# Altium project Controls_PcbPrj.PrjPcb
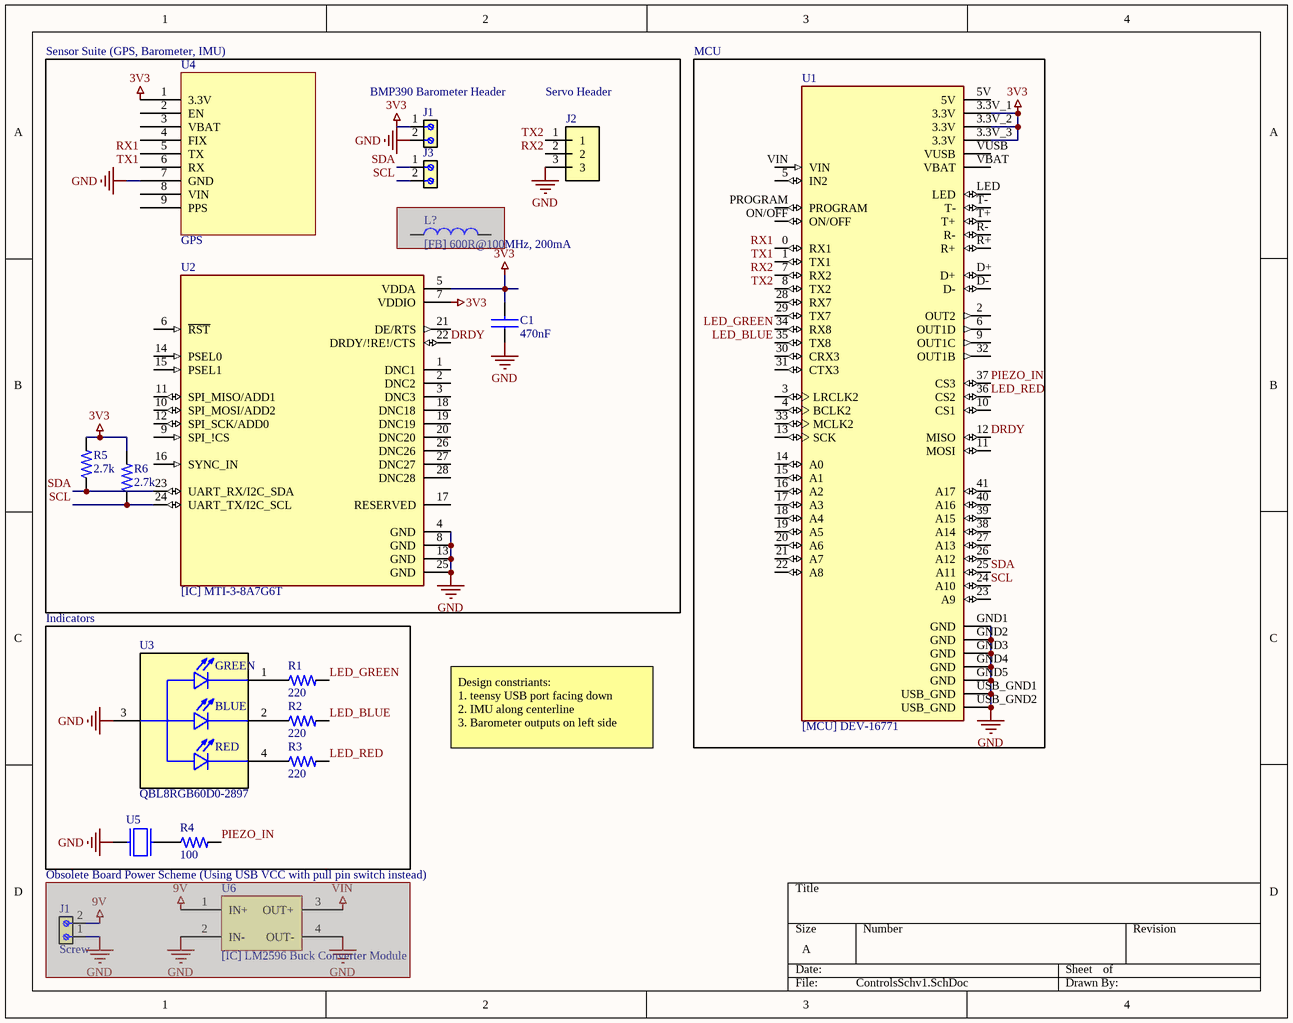
[diagram p0: ControlsSchv1.SchDoc]
1 sheet, 18 parts. Net scope: global (net labels, ports and power ports of the same name join across sheets).
Board file: ControlsPcbv3.PcbDoc

## Sheet ControlsSchv1.SchDoc
size A; SheetNumber: 1; SheetTotal: 1

### Parts
(Parts that share a designator on the sheet are numbered #1, #2 ... from top to bottom, then left to right.)
C1  470nF  [[CAP] CAPC_TH_100MIL]
J1#1  [Connector] 691213510002  [[CONNECTOR] 5MM_2PORT_SCREW]  (value not drawn)
J1#2  Screw  [[CONN] 5MM_2PORT_SCREW]  (masked out: inside a compile mask, not in the netlist)
J2  [Connector]1x3_Header  [3POS_5MM_PHOENIX]  (value not drawn)
J3  [Connector] 691213510002  [[CONNECTOR] 5MM_2PORT_SCREW]  (value not drawn)
L?  [FB] 600R@100MHz, 200mA  [[FB] WE-CBF_0603_W2.6]  (masked out: inside a compile mask, not in the netlist)
R1  220  [[RES] 1/4W TH RES]
R2  220  [[RES] 1/4W TH RES]
R3  220  [[RES] 1/4W TH RES]
R4  100  [[RES] 1/4W TH RES]
R5  2.7k  [[RES] 1/4W TH RES]
R6  2.7k  [[RES] 1/4W TH RES]
U1  [MCU] DEV-16771  [[MCU] MODULE_DEV-16771]
U2  [IC] MTI-3-8A7G6T  [[IC] DIP28]
U3  QBL8RGB60D0-2897  [[LED] LED_QBL8RGB60D0-2897]
U4  GPS  [[IC] Ultimate-GPS-v3]
U5  [Act] PS1240P02BT  [[ACT] XDCR_PS1240P02BT - duplicate]  (value not drawn)
U6  [IC] LM2596 Buck Converter Module  [[IC] LM2596 Module - duplicate]  (masked out: inside a compile mask, not in the netlist)

### Blocks framed on the sheet
MCU: U1
Indicators: R1-R4 U3 U5

### Nets
3V3: C1.2(N) J1#1.1 R5.2 R6.2 U1.3.3V_1(3.3V) U1.3.3V_2(3.3V) U1.3.3V_3(3.3V) U2.5(VDDA) U2.7(VDDIO) U4.1(3.3V)
GND: C1.1(P) J1#1.2 J2.3 U1.GND1(GND) U1.GND2(GND) U1.GND3(GND) U1.GND4(GND) U1.GND5(GND) U1.USB_GND1(USB_GND) U1.USB_GND2(USB_GND) U2.4(GND) U2.8(GND) U2.13(GND) U2.25(GND) U3.3(COMMON_ANODE) U4.7(GND) U5.1
DRDY: U1.12(MISO) U2.22(DRDY/!RE!/CTS)
LED_BLUE: R2.2 U1.35(TX8)
LED_GREEN: R1.2 U1.34(RX8)
LED_RED: R3.2 U1.36(CS2)
PIEZO_IN: R4.2 U1.37(CS3)
RX1: U1.0(RX1) U4.5(TX)
RX2: J2.2 U1.7(RX2)
SCL: J3.2 R6.1 U1.24(A10) U2.24(UART_TX/I2C_SCL)
SDA: J3.1 R5.1 U1.25(A11) U2.23(UART_RX/I2C_SDA)
TX1: U1.1(TX1) U4.6(RX)
TX2: J2.1 U1.8(TX2)
NetR1_1: R1.1 U3.1(CATHODE_GREEN)
NetR2_1: R2.1 U3.2(CATHODE_BLUE)
NetR3_1: R3.1 U3.4(CATHODE_RED)
NetR4_1: R4.1 U5.2

Not connected (* = marked no-connect by the designer): U1 2(OUT2) 3(LRCLK2) 4(BCLK2) 5(IN2) 5V 6(OUT1D) 9(OUT1C) 10(CS1) 11(MOSI) 13(SCK) 14(A0) 15(A1) 16(A2) 17(A3) 18(A4) 19(A5) 20(A6) 21(A7) 22(A8) 23(A9) 26(A12) 27(A13) 28(RX7) 29(TX7) 30(CRX3) 31(CTX3) 32(OUT1B) 33(MCLK2) 38(A14) 39(A15) 40(A16) 41(A17) D+ D- LED ON/OFF PROGRAM R+ R- T+ T- VBAT VIN VUSB; U2 1(DNC1) 2(DNC2) 3(DNC3) 6(~{RST}) 9(SPI_!CS) 10(SPI_MOSI/ADD2) 11(SPI_MISO/ADD1) 12(SPI_SCK/ADD0) 14(PSEL0) 15(PSEL1) 16(SYNC_IN) 17(RESERVED) 18(DNC18) 19(DNC19) 20(DNC20) 21(DE/RTS) 26(DNC26) 27(DNC27) 28(DNC28); U4 2(EN) 3(VBAT) 4(FIX) 8(VIN) 9(PPS)

### Notes on the sheet
- (near U4) Sensor Suite (GPS, Barometer, IMU)
- (near J1#1) BMP390 Barometer Header
- (near J2) Servo Header
- Design constriants:
  1. teensy USB port facing down
  2. IMU along centerline
  3. Barometer outputs on left side
- Obsolete Board Power Scheme (Using USB VCC with pull pin switch instead)
- (in symbol QBL8RGB60D0-2897) GREEN; BLUE; RED

### Library data of the parts
C1 = [Cap] Ceramic Cap: Ceramic cap; MP: EEUFM1H101; MF: Panasonic; Package: RADIAL-2 Panasonic; Check_prices: https://www.snapeda.com/parts/EEUFM1H101/Panasonic/view-part/1510333/?ref=eda; Value: *; Price: None; Availability: In Stock; SnapEDA_Link: https://www.snapeda.com/parts/EEUFM1H101/Panasonic/view-part/1510333/?ref=snap
J1#1 J3 = [Connector] 691213510002: 2 Position Wire to Board Terminal Block Horizontal with Board 0.200 (5.08mm) Through Hole; MF: WÃ¼rth Elektronik; SnapEDA_Link: https://www.snapeda.com/parts/691213510002/W%25C3%25BCrth+Elektronik+Midcom/view-part/?ref=snap; Package: None; Value: *; MP: 691213510002; Check_prices: https://www.snapeda.com/parts/691213510002/W%25C3%25BCrth+Elektronik+Midcom/view-part/?ref=eda
J1#2 = [Conn] 691213510002: 2 Position Wire to Board Terminal Block Horizontal with Board 0.200 (5.08mm) Through Hole; MF: WÃ¼rth Elektronik; SnapEDA_Link: https://www.snapeda.com/parts/691213510002/W%25C3%25BCrth+Elektronik+Midcom/view-part/?ref=snap; Package: None; Value: *; MP: 691213510002; Check_prices: https://www.snapeda.com/parts/691213510002/W%25C3%25BCrth+Elektronik+Midcom/view-part/?ref=eda
J2 = [Connector]1x3_Header: PCB Terminal Screw 5mm 16AWG 400V 17.5A 3 Position COMBICON PT Series | Phoenix Contact 1935174; SnapEDA_Link: https://www.snapeda.com/parts/1935174/Phoenix+Contact/view-part/?ref=snap; Package: None; Value: *; MF: Phoenix Contact; MP: 1935174; Check_prices: https://www.snapeda.com/parts/1935174/Phoenix+Contact/view-part/?ref=eda
L? = [FB] WE-CBF_0603: Size 0603; Z @ 100 MHz = 600 â„¦; Zmax = 800 â„¦ @ 200 MHz; IR = 1000 mA; RDC = 0.2 â„¦; MF: Wurth Elektronik; MP: 742792651; SnapEDA_Link: https://www.snapeda.com/parts/742792651/Wurth+Electronics/view-part/?ref=snap; Package: 0603 WÃ¼rth Elektronik; Value: *; Check_prices: https://www.snapeda.com/parts/742792651/Wurth+Electronics/view-part/?ref=eda
R1-R6 = [Res] RC0603FR-0710KL: 10 kOhms Â±1% 0.1W, 1/10W Chip Resistor 0603 (1608 Metric) Moisture Resistant Thick Film; MF: Yageo; SnapEDA_Link: https://www.snapeda.com/parts/RC0603FR-0710KL/Yageo/view-part/?ref=snap; Package: 0603 Yageo; Value: *; MP: RC0603FR-0710KL; Check_prices: https://www.snapeda.com/parts/RC0603FR-0710KL/Yageo/view-part/?ref=eda
U1 = [MCU] DEV-16771: RT1062 Teensy 4.1 series ARM® Cortex®-M7 MPU Embedded Evaluation Board; MF: SparkFun Electronics; SnapEDA_Link: https://www.snapeda.com/parts/DEV-16771/SparkFun+Electronics/view-part/?ref=snap; Package: None; Value: *; MP: DEV-16771; Check_prices: https://www.snapeda.com/parts/DEV-16771/SparkFun+Electronics/view-part/?ref=eda
U2 = [IC] MTI-3-8A7G6T: Accelerometer, Gyroscope, Magnetometer, 9 Axis Sensor IÂ²C, SPI Output; MF: XSens Technologies; Price: None; Check_prices: https://www.snapeda.com/parts/MTI-3-8A7G6T/XSens%20Technologies%20BV/view-part/1464840/?ref=eda; Value: *; SnapEDA_Link: https://www.snapeda.com/parts/MTI-3-8A7G6T/XSens%20Technologies%20BV/view-part/1464840/?ref=snap; Availability: Bad; MP: MTI-3-8A7G6T; Package: SMD-28 Xsens Technologies
U3 = QBL8RGB60D0-2897: Red, Green, Blue (RGB) 624nm Red, 525nm Green, 470nm Blue LED Indication - Discrete 2V Red, 3.2V Green, 3.2V Blue Radial; MF: QT Brightek (QTB); SnapEDA_Link: https://www.snapeda.com/parts/QBL8RGB60D0-2897/QT/view-part/?ref=snap; Package: Radial QT Brightek (QTB); Value: *; MP: QBL8RGB60D0-2897; Check_prices: https://www.snapeda.com/parts/QBL8RGB60D0-2897/QT/view-part/?ref=eda
U4 = Ultimate-GPS-v3
U5 = [Act] PS1240P02BT: Buzzers Transducer, Externally Driven Piezo 3V 4kHz 60dB @ 3V, 10cm Through Hole PC Pins; MF: TDK; MP: PS1240P02BT; Availability: Unavailable; Package: 2020 TDK; Value: *; Price: None; SnapEDA_Link: https://www.snapeda.com/parts/PS1240P02BT/TDK/view-part/53420/?ref=snap